# Altium schematic sheet FPGA.SchDoc
size A4; SheetNumber: 6; SheetTotal: 18
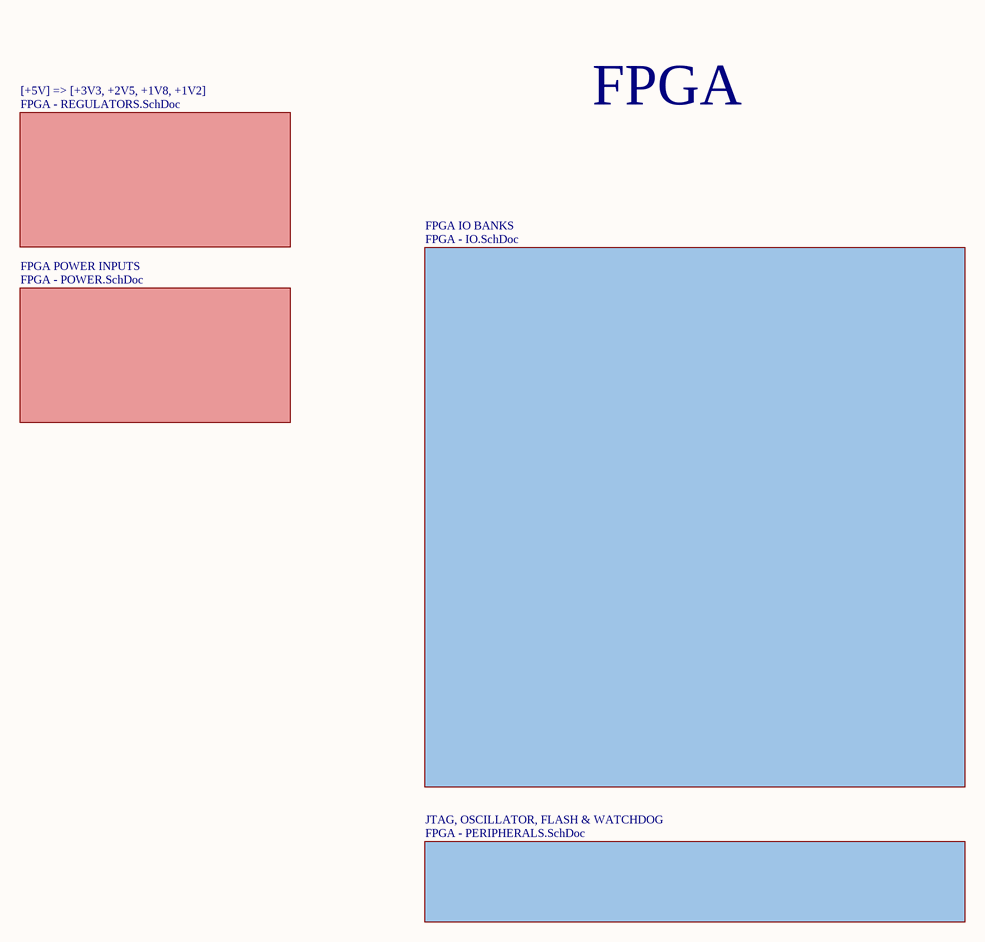
[diagram p0: FPGA.SchDoc]

## Sub-sheets
[+5V] => [+3V3, +2V5, +1V8, +1V2] = FPGA - REGULATORS.SchDoc: no entries
FPGA IO BANKS = FPGA - IO.SchDoc: no entries
FPGA POWER INPUTS = FPGA - POWER.SchDoc: no entries
JTAG, OSCILLATOR, FLASH & WATCHDOG = FPGA - PERIPHERALS.SchDoc: no entries

## Notes on the sheet
- FPGA